# EAGLE design ADC4 (EAGLE 9.2.2)
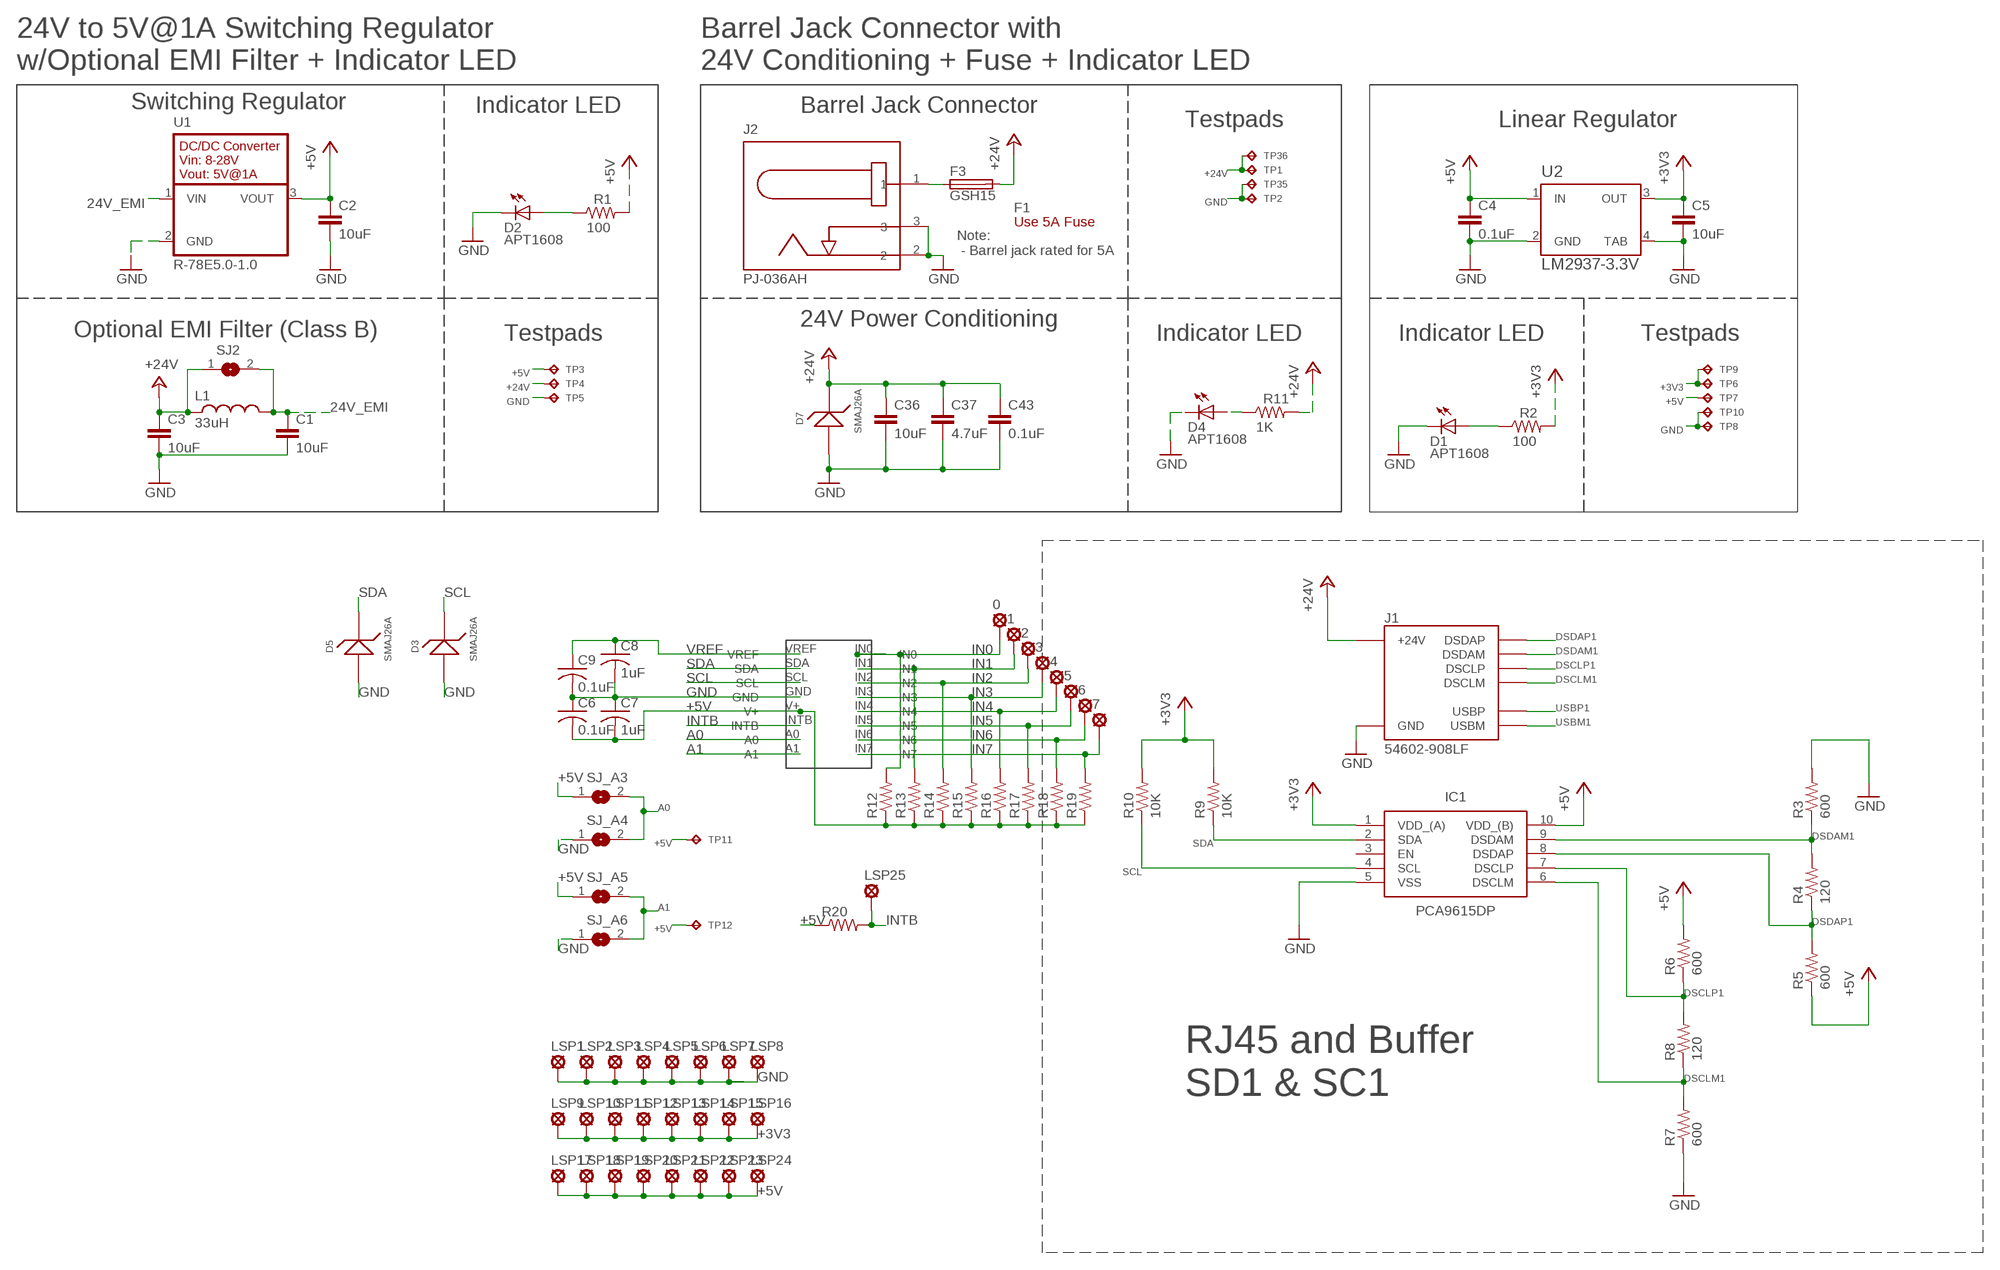
[diagram p0: schematic, sheet 1]

## Parts
0  LSP13  [LSP13]
1  LSP13  [LSP13]
2  LSP13  [LSP13]
3  LSP13  [LSP13]
4  LSP13  [LSP13]
5  LSP13  [LSP13]
6  LSP13  [LSP13]
7  LSP13  [LSP13]
C1  10uF  10UF-GMK212BBJ106KG-T  [C0805]
C2  10uF  10UF-GMK212BBJ106KG-T  [C0805]
C3  10uF  10UF-GMK212BBJ106KG-T  [C0805]
C4  0.1uF  0.1UF-C0603C104K5RACTU  [C0603]
C5  10uF  10UF-GMK212BBJ106KG-T  [C0805]
C6  0.1uF  C-USC0603  [C0603]
C7  1uF  C-USC0603  [C0603]
C8  1uF  C-USC0603  [C0603]
C9  0.1uF  C-USC0603  [C0603]
C36  10uF  10UF-GMK212BBJ106KG-T  [C0805]
C37  4.7uF  4.7UF-CL21A475KBQNNNE  [C0805]
C43  0.1uF  0.1UF-C0603C104K5RACTU  [C0603]
D1  APT1608  APT1608CGCK  [CHIPLED_0603]
D2  APT1608  APT1608CGCK  [CHIPLED_0603]
D3  SMAJ26A  SMAJ26A-13-F  [SMA]
D4  APT1608  APT1608CGCK  [CHIPLED_0603]
D5  SMAJ26A  SMAJ26A-13-F  [SMA]
D7  SMAJ26A  SMAJ26A-13-F  [SMA]
F1  Use 5A Fuse  0217005.MXP  [FUSE-CARTRIDGE]
F3  GSH15  [GSH15]
IC1  PCA9615DP  [SOP50P490X110-10N]
J1  54602-908LF  OPENAG-V1-RJ45PTH  [OPENAG-V1-RJ45]
J2  PJ-036AH  BARREL-JACK-PJ-036AH-SMT-TR  [BARREL-JACK-PJ-036AH]
L1  33uH  33UH-29333C  [29333C]
LSP1  LSP13  [LSP13]
LSP2  LSP13  [LSP13]
LSP3  LSP13  [LSP13]
LSP4  LSP13  [LSP13]
LSP5  LSP13  [LSP13]
LSP6  LSP13  [LSP13]
LSP7  LSP13  [LSP13]
LSP8  LSP13  [LSP13]
LSP9  LSP13  [LSP13]
LSP10  LSP13  [LSP13]
LSP11  LSP13  [LSP13]
LSP12  LSP13  [LSP13]
LSP13  LSP13  [LSP13]
LSP14  LSP13  [LSP13]
LSP15  LSP13  [LSP13]
LSP16  LSP13  [LSP13]
LSP17  LSP13  [LSP13]
LSP18  LSP13  [LSP13]
LSP19  LSP13  [LSP13]
LSP20  LSP13  [LSP13]
LSP21  LSP13  [LSP13]
LSP22  LSP13  [LSP13]
LSP23  LSP13  [LSP13]
LSP24  LSP13  [LSP13]
LSP25  LSP10  [LSP10]
R1  100  100OHM-RC0603JR-07100RL  [RC0603N]
R2  100  100OHM-RC0603JR-07100RL  [RC0603N]
R3  600  R-US_R0603  [R0603]
R4  120  R-US_R0603  [R0603]
R5  600  R-US_R0603  [R0603]
R6  600  R-US_R0603  [R0603]
R7  600  R-US_R0603  [R0603]
R8  120  R-US_R0603  [R0603]
R9  10K  R-US_R0603  [R0603]
R10  10K  R-US_R0603  [R0603]
R11  1K  1K-ERJ-PB3D1001V  [RC0603N]
R12  R-US_R0603  [R0603]
R13  R-US_R0603  [R0603]
R14  R-US_R0603  [R0603]
R15  R-US_R0603  [R0603]
R16  R-US_R0603  [R0603]
R17  R-US_R0603  [R0603]
R18  R-US_R0603  [R0603]
R19  R-US_R0603  [R0603]
R20  R-US_R0603  [R0603]
SJ2  EMI-BYPASS  [EMI-BYPASS]
SJ_A3  SOLDERJUMPERREFLOW_NOPASTE  [SJ1]
SJ_A4  SOLDERJUMPERREFLOW_NOPASTE  [SJ1]
SJ_A5  SOLDERJUMPERREFLOW_NOPASTE  [SJ1]
SJ_A6  SOLDERJUMPERREFLOW_NOPASTE  [SJ1]
TP1  TPTP04R  [TP04R]
TP2  TPTP04R  [TP04R]
TP3  TPTP06R  [TP06R]
TP4  TPTP06R  [TP06R]
TP5  TPTP06R  [TP06R]
TP6  TPTP04R  [TP04R]
TP7  TPTP04R  [TP04R]
TP8  TPTP04R  [TP04R]
TP9  TPTP04R  [TP04R]
TP10  TPTP04R  [TP04R]
TP11  TPTP04R  [TP04R]
TP12  TPTP04R  [TP04R]
TP35  TPTP04R  [TP04R]
TP36  TPTP04R  [TP04R]
U1  R-78E5.0-1.0  [R-78E5.0-1.0]
U2  LM2937-3.3V  LM2937IMP-3.3/NOPB  [MP04A]
U$1  ADC128D818  [TSSOP16]

## Nets
24V_EMI: C1.1 L1.2 SJ2.2 U1.1(VIN)
24V_IN: F3.1 J2.1
+3V3: C5.1 IC1.1(VDD_(A)) LSP9.MP LSP10.MP LSP11.MP LSP12.MP LSP13.MP LSP14.MP LSP15.MP LSP16.MP R2.2 R9.2 R10.2 TP6.1(TP) TP9.1(TP) U2.3(OUT)
+5V: C2.1 C4.1 C6.2 C7.2 IC1.10(VDD_(B)) LSP17.MP LSP18.MP LSP19.MP LSP20.MP LSP21.MP LSP22.MP LSP23.MP LSP24.MP R1.2 R5.1 R6.2 R12.1 R13.1 R14.1 R15.1 R16.1 R17.1 R18.1 R19.1 R20.1 SJ_A3.1 SJ_A5.1 TP3.TP TP7.1(TP) TP11.1(TP) TP12.1(TP) U1.3(VOUT) U2.1(IN) U$1.V+
+24V: C3.1 C36.1 C37.1 C43.1 D7.1 F3.2 J1.24V(6)(+24V) L1.1 R11.2 SJ2.1 TP1.1(TP) TP4.TP TP36.1(TP)
A0: SJ_A3.2 SJ_A4.2 U$1.A0
A1: SJ_A5.2 SJ_A6.2 U$1.A1
DSCLM1: IC1.6(DSCLM) J1.DSCLM(5)(DSCLM) R7.2 R8.1
DSCLP1: IC1.7(DSCLP) J1.DSCLP(4)(DSCLP) R6.1 R8.2
DSDAM1: IC1.9(DSDAM) J1.DSDAM(2)(DSDAM) R3.1 R4.2
DSDAP1: IC1.8(DSDAP) J1.DSDAP(1)(DSDAP) R4.1 R5.2
GND: C1.2 C2.2 C3.2 C4.2 C5.2 C6.1 C7.1 C8.2 C9.2 C36.2 C37.2 C43.2 D1.C D2.C D3.2 D4.C D5.2 D7.2 IC1.5(VSS) J1.GND(3)(GND) J2.2 J2.3 LSP1.MP LSP2.MP LSP3.MP LSP4.MP LSP5.MP LSP6.MP LSP7.MP LSP8.MP R3.2 R7.1 SJ_A4.1 SJ_A6.1 TP2.1(TP) TP5.TP TP8.1(TP) TP10.1(TP) TP35.1(TP) U1.2(GND) U2.2(GND) U2.4(TAB) U$1.GND
IN0: 0.MP R12.2 U$1.IN0
IN1: 1.MP R13.2 U$1.IN1
IN2: 2.MP R14.2 U$1.IN2
IN3: 3.MP R15.2 U$1.IN3
IN4: 4.MP R16.2 U$1.IN4
IN5: 5.MP R17.2 U$1.IN5
IN6: 6.MP R18.2 U$1.IN6
IN7: 7.MP R19.2 U$1.IN7
INTB: LSP25.MP R20.2 U$1.INTB
N$1: D1.A R2.1
N$2: D2.A R1.1
N$4: D4.A R11.1
SCL: D3.1 IC1.4(SCL) R10.1 U$1.SCL
SDA: D5.1 IC1.2(SDA) R9.1 U$1.SDA
USBM1: J1.USBM(8)(USBM)
USBP1: J1.USBP(7)(USBP)
VREF: C8.1 C9.1 U$1.VREF
Unconnected: IC1.3(EN)

## Notes on the sheet
- 24V to 5V@1A Switching Regulator
  w/Optional EMI Filter + Indicator LED
- Barrel Jack Connector with
  24V Conditioning + Fuse + Indicator LED
- Switching Regulator | Indicator LED | Barrel Jack Connector
- Testpads | Linear Regulator
- Note:
   - Barrel jack rated for 5A
- 24V Power Conditioning
- Optional EMI Filter (Class B) | Testpads | Indicator LED | Indicator LED | Testpads
- RJ45 and Buffer
  SD1 & SC1

## Library data of the parts
0 1-7 LSP1-LSP24 = solpad:LSP13: SOLDER PAD drill 1.3 mm, distributor Buerklin, 12H562
C1-C3 C5 C36 = openag-capacitors:10UF-GMK212BBJ106KG-T: CAP CER 10UF 35V X5R 0805 Description: 10µF ±10% 35V Ceramic Capacitor X5R 0805 (2012 Metric) Technical Specifications: Capacitance: 10µF Tolerance: ±10% Rated Voltage: 35V Temperature Coefficient: X5R Operating Temperature: -55°C ~ 85°C Package / Case: 0805 (2012 Metric) Datasheet(s): GMK212BBJ106KG-T Spec <http://ds.yuden.co.jp/TYCOMPAS/ut/detail.do?productNo=GMK212BBJ106KG-T&fileName=GMK212BBJ106KG-T_SS&mode=specSheetDownload> Vendor(s): Digikey: 587-4893-1-ND <https://www.digikey.com/product-detail/en/taiyo-yuden/GMK212BBJ106KG-T/587-4893-1-ND/6563736>; MANUFACTURER: Taiyo Yuden; MPN: GMK212BBJ106KG-T; VENDOR: Digikey; VLINK: https://www.digikey.com/product-detail/en/taiyo-yuden/GMK212BBJ106KG-T/587-4893-1-ND/6563736; VPN: 587-4893-1-ND
C4 C43 = openag-capacitors:0.1UF-C0603C104K5RACTU: CAP CER 0.1UF 50V X7R 0603 Description: 0.1µF ±10% 50V Ceramic Capacitor X7R 0603 (1608 Metric) Technical Specifications: Capacitance: 0.1µF Tolerance: ±10% Rated Voltage: 50V Temperature Coefficient: X7R Operating Temperature: -55°C ~ 125°C Package / Case: 0603 (1608 Metric) Datasheet(s): X7R Dielectric, 6.3-250 VDC <https://search.kemet.com/component-edge/download/datasheet/C0603C104K5RACTU.pdf> Vendor(s): Digikey: 399-5089-1-ND <https://www.digikey.com/product-detail/en/kemet/C0603C104K5RACTU/399-5089-1-ND/1465623>; MANUFACTURER: Kemet; MPN: C0603C104K5RACTU; VENDOR: Digikey; VLINK: https://www.digikey.com/product-detail/en/kemet/C0603C104K5RACTU/399-5089-1-ND/1465623; VPN: 399-5089-1-ND
C6-C9 = rcl:C-US: CAPACITOR, American symbol; SPICEPREFIX: C
C37 = openag-capacitors:4.7UF-CL21A475KBQNNNE: CAP CER 4.7UF 50V X5R 0805 Description: 4.7µF ±10% 50V Ceramic Capacitor X5R 0805 (2012 Metric) Technical Specifications: Capacitance: 4.7uF Tolerance: ±10% Rated Voltage: 50V Temperature Coefficient: X5R Operating Temperature: -55°C ~ 85°C Package/Case: 0805 (2012 Metric) Datasheet(s): CL21A475KBQNNNE Characteristics <http://www.samsungsem.com/kr/front/downloadcms.do?path=/kr/support/product-search/mlcc/__icsFiles/afieldfile/2014/11/05&fileName=C_CL21A475KBQNNNE.pdf> Vendor(s): Digikey: 1276-1248-1-ND <https://www.digikey.com/product-detail/en/samsung-electro-mechanics/CL21A475KBQNNNE/1276-1248-1-ND/3889334>; MANUFACTURER: Samsung; MPN: CL21A475KBQNNNE; VENDOR: Digikey; VLINK: https://www.digikey.com/product-detail/en/samsung-electro-mechanics/CL21A475KBQNNNE/1276-1248-1-ND/3889334; VPN: 1276-1248-1-ND
D1 D2 D4 = openag-diodes:APT1608CGCK: LED GREEN CLEAR 0603 SMD Description: Green 570nm LED Indication - Discrete 2.1V 0603 (1608 Metric) Technical Specifications: Color: Green Lens Color: Colorless Lens Transparency: Clear Millicandela Rating: 50mcd Lens Style/Size: Rectangle with Flat Top, 1.20mm x 0.80mm Voltage - Forward (Vf) (Typ): 2.1V Current - Test: 20mA Viewing Angle: 120° Mounting Type: Surface Mount Wavelength - Dominant: 570nm Wavelength - Peak: 574nm Package / Case: 0603 (1608 Metric) Supplier Device Package: Chip LED Size / Dimension: 1.60mm L x 0.80mm W Height (Max): 0.75mm Datasheet(s): APT1608CGCK <http://www.kingbrightusa.com/images/catalog/SPEC/APT1608CGCK.pdf> Vendor(s): Digikey: 754-1116-1-ND <https://www.digikey.com/product-detail/en/kingbright/APT1608CGCK/754-1116-1-ND/1747833#>; MANUFACTURER: Kingbright; MPN: APT1608CGCK; VENDOR: Digikey; VLINK: https://www.digikey.com/product-detail/en/kingbright/APT1608CGCK/754-1116-1-ND/1747833#; VPN: 754-1116-1-ND
D3 D5 D7 = openag-diodes:SMAJ26A-13-F: TVS DIODE 26VWM 42.1VC SMA Description: TVS DIODE 26VWM 42.1VC SMA Technical Specifications: Type: Zener Voltage - Reverse Standoff (Typ): 26V Voltage - Breakdown (Min): 28.9V Voltage - Clamping (Max) @ Ipp: 42.1V Current - Peak Pulse (10/1000µs): 9.5A Power - Peak Pulse: 400W Power Line Protection: No Operating Temperature: -55°C ~ 150°C (TJ) DO-214AC, SMA Datasheet(s): SMAJ5.0(C)A - SMAJ200(C)A Vendor(s): Digikey: SMAJ26A-FDICT-ND <https://www.digikey.com/product-detail/en/diodes-incorporated/SMAJ26A-13-F/SMAJ26A-FDICT-ND/806583>; MANUFACTURER: Diodes Incorporated; MPN: SMAJ26A-13-F; VENDOR: Digikey; VLINK: https://www.digikey.com/product-detail/en/diodes-incorporated/SMAJ26A-13-F/SMAJ26A-FDICT-ND/806583; VPN: SMAJ26A-FDICT-ND
F1 = openag-fuses:0217005.MXP: FUSE GLASS 5A 250VAC 5X20MM Description: FUSE GLASS 5A 250VAC 5X20MM Technical Specifications: Fuse Type: Cartridge, Glass Current Rating: 5A Voltage Rating - AC: 250V Response Time: Fast Package / Case: 5mm x 20mm Mounting Type: Holder Breaking Capacity @ Rated Voltage: 50A Melting I²t: 42.795 Approvals: BSI, CE, CCC, CSA, KC, PSE, SEMKO, UR, VDE Operating Temperature: -55°C ~ 125°C Size / Dimension: 0.205" Dia x 0.787" L (5.20mm x 20.00mm) DC Cold Resistance: 0.0137 Ohms Datasheet(s): 217 Series Datasheet <http://www.littelfuse.com/~/media/electronics/datasheets/fuses/littelfuse_fuse_217_datasheet.pdf.pdf> Vendor(s): Digikey: F1725-ND <https://www.digikey.com/product-detail/en/littelfuse-inc/0217005.MXP/F1725-ND/777549#>; MANUFACTURER: Littelfuse Inc.; MPN: 0217005.MXP; VENDOR: Digikey; VLINK: https://www.digikey.com/product-detail/en/littelfuse-inc/0217005.MXP/F1725-ND/777549; VPN: F1725-ND
F3 = openag-fuses:GSH15: FUSE BLOCK CART 250V 6.3A PCB Description: Fuse Block 6.3A 250V 1 Circuit Cartridge PCB Technical Specifications: Fuseholder Type: Block Fuse Type: Cartridge For Use With/Related Products: 5mm x 20mm Fuse Size: 5mm x 20mm Number of Circuits: 1 Voltage: 250V Current Rating: 6.3A Mounting Type: PCB Orientation: Horizontal Termination Style: PC Pin Contact Material: Copper Alloy Contact Finish: Tin Datasheet(s): 649 Series <http://www.littelfuse.com/~/media/electronics/datasheets/fuse_blocks/littelfuse_fuse_block_649_datasheet.pdf.pdf> Vendor(s): Digikey: WK0011-ND <https://www.digikey.com/product-detail/en/littelfuse-inc/64900001039/WK0011-ND/245470>; MANUFACTURER: Littelfuse Inc.; MPN: 64900001039; VENDOR: Digikey; VLINK: https://www.digikey.com/product-detail/en/littelfuse-inc/64900001039/WK0011-ND/245470; VPN: WK0011-ND
IC1 = PCA9615DP:PCA9615DP: Buffer, ReDriver 2 Channel 400kHz 10-TSSOP Source: Datasheet <http://www.nxp.com/docs/en/data-sheet/PCA9615.pdf>; DESCRIPTION: Buffer, ReDriver 2 Channel 400kHz 10-TSSOP; HEIGHT: 1.1mm; MANUFACTURER_NAME: Nexperia; MANUFACTURER_PART_NUMBER: PCA9615DP; SUPPLIER_NAME: RS
J1 = openag_connector:OPENAG-V1-RJ45: Amphenol FCI - 54602-908LF - CONN MOD JACK 8P8C R/A UNSHLD Description: Jack Modular Connector 8p8c (RJ45, Ethernet) 90� Angle (Right) Unshielded Cat3 Technical Specifications: Connector Type: Jack Number of Positions/Contacts: 8p8c (RJ45, Ethernet) Number of Ports: 1 Number of Rows: 1 Mounting Type: Through Hole Orientation: 90� Angle (Right) Termination: Solder Shielding: Unshielded Ratings: Cat3 Features: Board Lock LED Color: Does Not Contain LED Tab Direction: Down Contact Material: Copper Alloy Contact Finish: Gold Contact Finish Thickness: 15�in (0.38�m) Housing Material: Polyester, Glass Filled Operating Temperature: -40�C ~ 70�C Datasheet(s): 54601-x04(zzz)WPLF Drawing <http://cdn.amphenol-icc.com/media/wysiwyg/files/drawing/c-bmj-0102.pdf> Vendor(s): Digikey: 609-1046-ND <https://www.digikey.com/product-detail/en/amphenol-fci/54602-908LF/609-1046-ND/1001360>; POPULATE: YES; VERIFIED: NO
J2 = openag-connectors:BARREL-JACK-PJ-036AH-SMT-TR: CONN PWR JACK 2X5.5MM SOLDER Description: Power Barrel Connector Jack 2.10mm ID (0.083"), 5.50mm OD (0.217") Surface Mount, Right Angle Technical Specifications: Connector Type: Jack Gender: Male Industry Recognized Mating Diameter: 2.10mm ID (0.083"), 5.50mm OD (0.217") Actual Diameter: 0.078" (2.00mm ID), 0.248" (6.30mm OD) Number of Positions/Contacts: 2 Conductors, 3 Contacts Internal Switch(s): Single Switch, Normally Closed Mounting Type: Surface Mount, Right Angle Termination: Solder Shielding: Unshielded Voltage - Rated: 24VDC Current Rating: 5A Mating Length/Depth: 0.360" (9.15mm) Contact Material - Plating: Silver Operating Temperature: -25°C ~ 85°C Housing Material: Polyamide (PA6T), Nylon 6T Contact Material: Brass; Copper Alloy Body Color: Black Datasheet(s): PJ-036AH-SMT-TR <http://www.cui.com/product/resource/digikeypdf/pj-036ah-smt-tr.pdf> Vendor(s): Digikey: CP-036AHPJCT-ND <https://www.digikey.com/product-detail/en/cui-inc/PJ-036AH-SMT-TR/CP-036AHPJCT-ND/1530994>; MANUFACTURER: CUI Inc.; MPN: PJ-036AH-SMT-TR; VENDOR: Digikey; VLINK: https://www.digikey.com/product-detail/en/cui-inc/PJ-036AH-SMT-TR/CP-036AHPJCT-ND/1530994; VPN: CP-036AHPJCT-ND
L1 = openag-inductors:33UH-29333C: FIXED IND 33UH 1A 120 MOHM SMD Description: 33µH Shielded Wirewound Inductor 1A 120 mOhm Max Nonstandard Technical Specifications: Type: Wirewound Inductance: 33µH Current Rating: 1A Shielding: Shielded DC Resistance (DCR): 120 mOhm Max Operating Temperature: -40°C ~ 85°C Frequency - Test: 10kHz Mounting Type: Surface Mount Package / Case: Nonstandard Size / Dimension: 0.283" L x 0.283" W (7.20mm x 7.20mm) Height - Seated (Max): 0.157" (4.00mm) Datasheet(s): 2900 Series <https://www.murata-ps.com/data/magnetics/kmp_2900.pdf> Vendor(s): Digikey: 811-1138-1-ND <https://www.digikey.com/product-detail/en/murata-power-solutions-inc/29333C/811-1138-1-ND/1924860>; MANUFACTURER: Murata Power Solutions Inc.; MPN: 29333C; VENDOR: Digikey; VLINK: https://www.digikey.com/product-detail/en/murata-power-solutions-inc/29333C/811-1138-1-ND/1924860; VPN: 811-1138-1-ND
LSP25 = solpad:LSP10: SOLDER PAD drill 1.0 mm, distributor Buerklin, 12H555
R1 R2 = openag-resistors:100OHM-RC0603JR-07100RL: RES SMD 100 OHM 5% 1/10W 0603 Description: 100 Ohms ±5% 0.1W, 1/10W Chip Resistor 0603 (1608 Metric) Moisture Resistant Thick Film Technical Specifications: Resistance: 100 Ohms Tolerance: ±5% Power (Watts): 0.1W, 1/10W Composition: Thick Film Features: Moisture Resistant Temperature Coefficient: ±100ppm/°C Operating Temperature: -55°C ~ 155°C Package / Case: 0603 (1608 Metric) Supplier Device Package: 0603 Size / Dimension: 0.063" L x 0.032" W (1.60mm x 0.80mm) Height - Seated (Max): 0.022" (0.55mm) Number of Terminations: 2 Datasheet(s): Thick Film Chip Resistor Intro <http://www.yageo.com.tw/exep/pages/download/literatures/PYu-R_INT-thick_7.pdf> Chip Resistor Marking <http://www.yageo.com/exep/pages/download/literatures/PYu-R_Marking_2.pdf> RC Series, L Datasheet <http://www.yageo.com/documents/recent/PYu-RC_Group_51_RoHS_L_8.pdf> Vendor(s): Digikey: 311-100GRCT-ND <https://www.digikey.com/product-detail/en/yageo/RC0603JR-07100RL/311-100GRCT-ND/729644>; MANUFACTURER: Yageo; MPN: RC0603JR-07100RL; VENDOR: Digikey; VLINK: https://www.digikey.com/product-detail/en/yageo/RC0603JR-07100RL/311-100GRCT-ND/729644; VPN: 311-100GRCT-ND
R3-R10 R12-R19 = rcl:R-US_: RESISTOR, American symbol; SPICEPREFIX: R
R11 = openag-resistors:1K-ERJ-PB3D1001V: RES SMD 1K OHM 0.5% 1/5W 0603 Description: 1 kOhms ±0.5% 0.2W, 1/5W Chip Resistor 0603 (1608 Metric) Automotive AEC-Q200, Pulse Withstanding Thick Film Technical Specifications: Resistance: 1 kOhms Tolerance: ±0.5% Power: 0.2W, 1/5W Operating Temperature: -55°C ~ 155°C Package / Case: 0603 (1608 Metric) Datasheet(s): ERJ-PB3, PB6 Series, High Precision Datasheet <https://industrial.panasonic.com/cdbs/www-data/pdf/RDM0000/AOA0000C328.pdf> Vendor(s): Digikey: P20283CT-ND <https://www.digikey.com/product-detail/en/panasonic-electronic-components/ERJ-PB3D1001V/P20283CT-ND/6214538>; MANUFACTURER: Panasonic; MPN: P20283CT-ND; VENDOR: Digikey; VLINK: https://www.digikey.com/product-detail/en/panasonic-electronic-components/ERJ-PB3D1001V/P20283CT-ND/6214538; VPN: P20283CT-ND
R20 = resistor:R-US_: RESISTOR, American symbol
SJ2 = openag-connectors:EMI-BYPASS: EMI Bypass Solder Jumper; MPN: N/A
SJ_A3-SJ_A6 = openag-connectors:SOLDERJUMPER: SMD Solder JUMPER Solder the two pads together to create a connection, or remove the solder to break it. REFLOW - Use this footprint for solder paste and reflow ovens. WAVE - Use this footprint for hand-soldering (larger pads). CLOSED - Has a trace between the two pads to ensure it is closed by default. The trace needs to be cut to disable the jumper, and can be closed again by creating a solder bridge between the two pads.; MPN: N/A
TP1-TP12 TP35 TP36 = openag-testpads:TP: Test pad; MPN: N/A
U1 = openag-regulators:R-78E5.0-1.0: DC/DC CONVERTER 5V 5W Description: Linear Regulator Replacement DC DC Converter 1 Output 5V 1A 8V - 28V Input Technical Specifications: Type: Linear Regulator Replacement Number of Outputs: 1 Voltage - Input (Min): 8V Voltage - Input (Max): 28V Voltage - Output 1: 5V Current - Output (Max): 1A Power (Watts): 5W Applications: ITE (Commercial) Features: SCP Operating Temperature: -40°C ~ 85°C Efficiency: 91% Mounting Type: Through Hole Package / Case: 3-SIP Module Size / Dimension: 0.46" L x 0.33" W x 0.41" H (11.6mm x 8.5mm x 10.4mm) Datasheet(s): R-78E-1.0 Series Datasheet <https://www.recom-power.com/pdf/Innoline/R-78Exx-1.0.pdf> Vendor(s): Digikey: 945-2201-ND <https://www.digikey.com/product-detail/en/recom-power/R-78E5.0-1.0/945-2201-ND/4930585>; MANUFACTURER: Recom Power; MPN: R-78E5.0-1.0; VENDOR: Digikey; VLINK: https://www.digikey.com/product-detail/en/recom-power/R-78E5.0-1.0/945-2201-ND/4930585; VPN: 945-2201-ND
U2 = openag-regulators:LM2937IMP-3.3/NOPB: IC REG LIN 3.3V 400MA SOT223-4 Description: Linear Voltage Regulator IC Positive Fixed 1 Output 3.3V 400mA SOT-223-4 Technical Specifications: Output Configuration: Positive Output Type: Fixed Number of Regulators: 1 Voltage - Input (Max): 26V Voltage - Output (Min/Fixed): 3.3V Voltage Dropout (Max): 1V @ 50mA Current - Output: 400mA Current - Quiescent (Iq): 2mA Current - Supply (Max): 1.25A Protection Features: Over Temperature, Reverse Polarity, Short Circuit Operating Temperature: -40°C ~ 85°C Mounting Type: Surface Mount Package / Case: TO-261-4, TO-261AA Supplier Device Package: SOT-223-4 Base Part Number: LM2937 Datasheet(s): LM2937-2.5, LM2937-3.3 Datasheet <http://www.ti.com/lit/ds/symlink/lm2937-2.5.pdf> Vendor(s): Digikey: LM2937IMP-3.3/NOPBCT-ND <https://www.digikey.com/product-detail/en/texas-instruments/LM2937IMP-3.3-NOPB/LM2937IMP-3.3-NOPBCT-ND/270742#>; MANUFACTURER: Texas Instruments; MPN: LM2937IMP-3.3/NOPB; VENDOR: Digikey; VLINK: https://www.digikey.com/product-detail/en/texas-instruments/LM2937IMP-3.3-NOPB/LM2937IMP-3.3-NOPBCT-ND/270742#; VPN: LM2937IMP-3.3/NOPBCT-ND
U$1 = untitled:ADC128D818

## Net classes
0 default: width 0.305 mm, drill 0.254 mm, clearance 0.254 mm

## Board
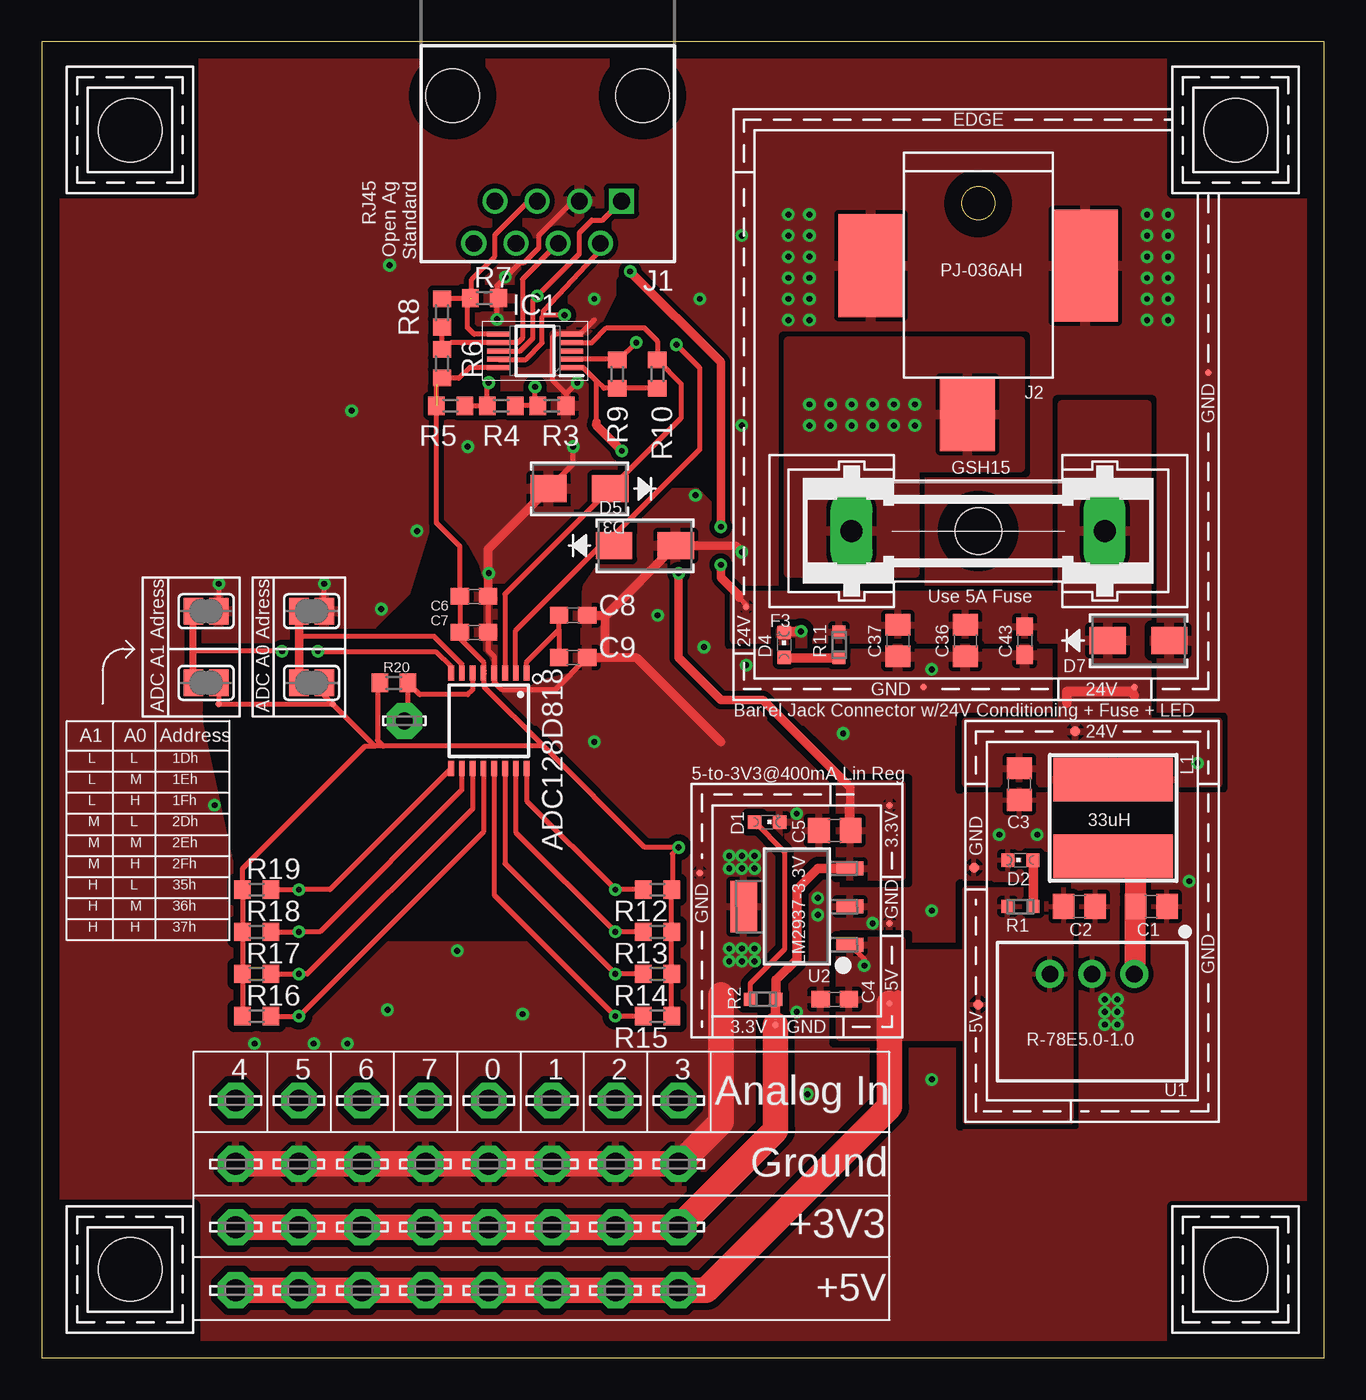
[diagram p1: board, top side]
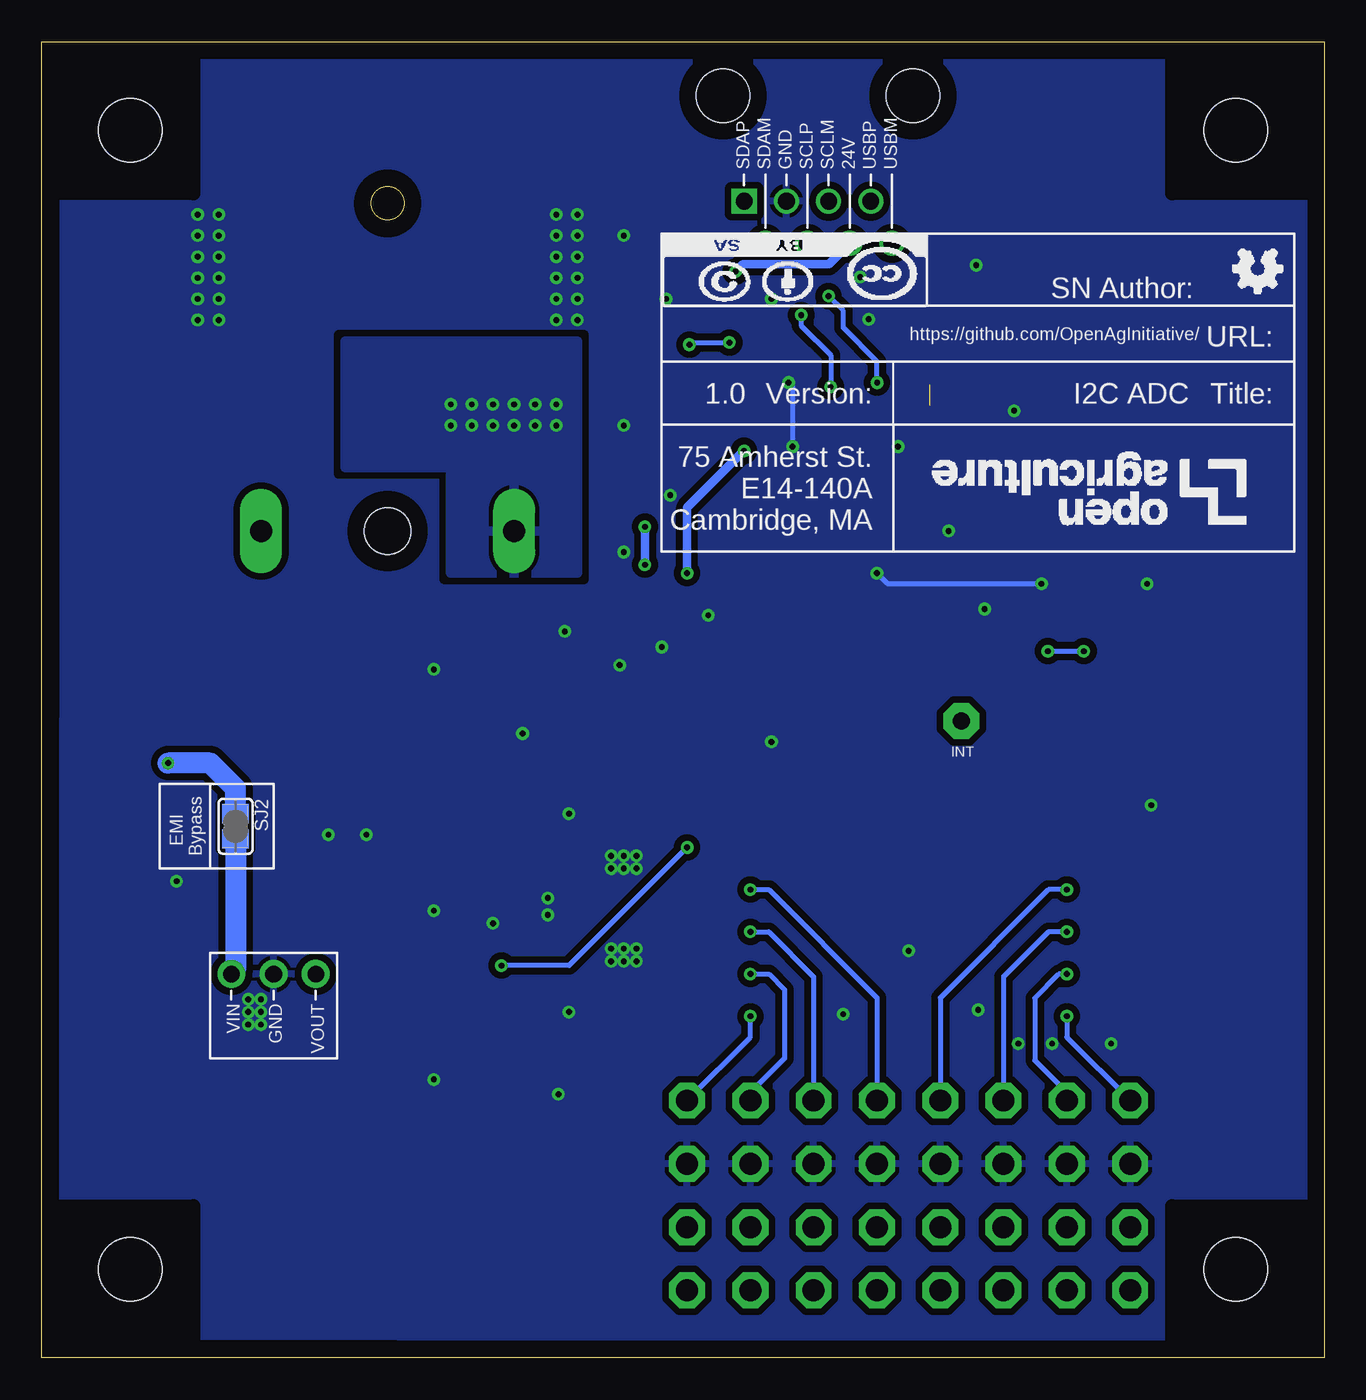
[diagram p2: board, bottom side, seen from below]

Size 77.22 x 79.25 mm. Coordinates in mm from the lower left corner, seen from the top.
Outline: 0,79.25 0,0 77.22,0 77.22,79.25 0,79.25
Copper layers (1*16): Top 0.035mm / dielectric 1.5mm / Bottom 0.035mm
Design rules "default": minimum track width 6mil, minimum drill 0.35mm, track to track 6mil, track to pad 6mil, pad to pad 6mil, via to via 6mil, smd to smd 6mil, copper to edge 40mil, drill to drill 6mil, minimum pad ring 10mil, minimum via ring 8mil, stop-mask expansion 4mil, vias tented up to drill 0mil, thermal gap 10mil
tRestrict: 18 lines

### Footprints (pad centres in the part's own frame; a part is rotated, then mirrored left to right if it is on the bottom)
LSP13 = drill 1.321 pad 2.159 octagon: MP 0,0
C0805 = smd 1.3 x 1.5: 1 -0.95,0; 2 0.95,0
C0603 = smd 1.1 x 1: 1 -0.85,0; 2 0.85,0
CHIPLED_0603 = smd 0.8 x 0.8: A 0,-0.75; C 0,0.75
SMA = smd 2.18 x 1.63: 1 -1.857,0; 2 1.857,0
GSH15 = drill 1.321 pad 2.54 long: 1 -7.62,0; 2 7.62,0 | hole 2.794: 0,0
SOP50P490X110-10N = smd 1.4 x 0.3: 1 -2.2,1; 2 -2.2,0.5; 3 -2.2,0; 4 -2.2,-0.5; 5 -2.2,-1; 6 2.2,-1; 7 2.2,-0.5; 8 2.2,0; 9 2.2,0.5; 10 2.2,1
OPENAG-V1-RJ45 = drill 1: 24V(6) 1.905,8.89; DSCLM(5) 0.635,6.35; DSCLP(4) -0.635,8.89; DSDAM(2) -3.175,8.89; GND(3) -1.905,6.35; USBM(8) 4.445,8.89; USBP(7) 3.175,6.35 | drill 1 square: DSDAP(1) -4.445,6.35 | hole 3.2: -5.715,0; 5.715,0
BARREL-JACK-PJ-036AH = smd 4.4 x 3.3: 1 2.2,-0.65 | smd 6.75 x 3.9: 2 -6.75,6.45 | smd 6.2 x 3.9: 3 -6.75,-6.45
29333C = smd 2.6 x 7.2: 1 -2.3,0; 2 2.3,0
LSP10 = drill 1.016 pad 2.159 octagon: MP 0,0
RC0603N = smd 0.756 x 0.8: 1 -0.778,0; 2 0.778,0
R0603 = smd 1 x 1.1: 1 -0.85,0; 2 0.85,0
EMI-BYPASS = smd 1.168 x 1.6: 1 -0.762,0.254; 2 0.762,0.254
SJ1 = smd 1.168 x 1.6: 1 -0.762,0; 2 0.762,0
TP04R = smd 0.4 x 0.4: 1 0,0
TP06R = smd 0.6 x 0.6: TP 0,0
R-78E5.0-1.0 = drill 1 pad 1.676: 1 -2.54,0; 2 0,0; 3 2.54,0
MP04A = smd 1.6 x 0.838: 1 -3.2,2.3; 2 -3.2,0; 3 -3.2,-2.3 | smd 1.6 x 3.099: 4 3.2,0
TSSOP16 = smd 0.9 x 0.35: A0 -2.875,-1.625; A1 -2.875,-2.275; GND -2.875,0.325; IN0 2.875,2.275; IN1 2.875,1.625; IN2 2.875,0.975; IN3 2.875,0.325; IN4 2.875,-0.325; IN5 2.875,-0.975; IN6 2.875,-1.625; IN7 2.875,-2.275; INTB -2.875,-0.975; SCL -2.875,0.975; SDA -2.875,1.625; V+ -2.875,-0.325; VREF -2.875,2.275
CORNER = hole 3.81: 0,0

### Placement (x,y rotation side)
0  26.92,15.49 0 top
1  30.73,15.49 0 top
2  34.54,15.49 0 top
3  38.35,15.49 0 top
4  11.68,15.49 0 top
5  15.49,15.49 0 top
6  19.3,15.49 0 top
7  23.11,15.49 0 top
ATTRIBUTES  [DOCFIELD]  1.79,67.67 180 bottom
C1  66.8,27.18 0 top
C2  62.48,27.18 0 top
C3  58.86,34.54 270 top
C4  47.75,21.59 180 top
C5  47.75,31.75 180 top
C6  26.04,45.85 180 top
C7  26.04,43.69 180 top
C8  32,44.7 0 top
C9  32,42.16 0 top
C36  55.63,43.18 270 top
C37  51.56,43.18 270 top
C43  59.18,43.18 270 top
D1  43.69,32.26 270 top
D2  58.93,29.97 90 top
D3  32.38,52.32 180 top
D4  44.7,42.93 0 top
D5  36.32,48.89 0 top
D7  66.04,43.18 0 top
F1  53.34,45.47 0 top
F3  56.39,49.78 0 top
IC1  29.71,60.62 180 top
J1  30.47,75.99 180 top
J2  56.39,59 270 top
L1  64.52,32.51 270 top
LSP1  11.68,11.68 0 top
LSP2  15.49,11.68 0 top
LSP3  19.3,11.68 0 top
LSP4  23.11,11.68 0 top
LSP5  26.92,11.68 0 top
LSP6  30.73,11.68 0 top
LSP7  34.54,11.68 0 top
LSP8  38.35,11.68 0 top
LSP9  11.68,7.87 0 top
LSP10  15.49,7.87 0 top
LSP11  19.3,7.87 0 top
LSP12  23.11,7.87 0 top
LSP13  26.92,7.87 0 top
LSP14  30.73,7.87 0 top
LSP15  34.54,7.87 0 top
LSP16  38.35,7.87 0 top
LSP17  11.68,4.06 0 top
LSP18  15.49,4.06 0 top
LSP19  19.3,4.06 0 top
LSP20  23.11,4.06 0 top
LSP21  26.92,4.06 0 top
LSP22  30.73,4.06 0 top
LSP23  34.54,4.06 0 top
LSP24  38.35,4.06 0 top
LSP25  21.84,38.35 0 top
R1  58.93,27.18 180 top
R2  43.43,21.59 0 top
R3  30.72,57.32 0 top
R4  27.68,57.32 0 top
R5  24.63,57.32 0 top
R6  24.12,59.86 270 top
R7  26.66,63.8 180 top
R8  24.12,62.91 270 top
R9  34.66,59.23 270 top
R10  37.07,59.23 270 top
R11  48.01,42.93 90 top
R12  37.08,28.19 180 top
R13  37.08,25.65 180 top
R14  37.08,23.11 180 top
R15  37.08,20.57 180 top
R16  12.95,20.57 0 top
R17  12.95,23.11 0 top
R18  12.95,25.65 0 top
R19  12.95,28.19 0 top
R20  21.21,40.64 0 top
SJ2  65.79,32 270 bottom
SJ_A3  16.26,40.64 180 top
SJ_A4  16.26,44.96 180 top
SJ_A5  9.91,40.64 180 top
SJ_A6  9.91,44.96 180 top
TP1  65.79,40.39 0 top
TP2  53.09,40.39 0 top
TP3  56.39,21.27 180 top
TP4  62.23,37.72 180 top
TP5  56.13,29.53 180 top
TP6  44.2,20.07 90 top
TP7  51.05,21.34 90 top
TP8  39.62,29.21 90 top
TP9  51.05,33.27 90 top
TP10  51.05,26.16 90 top
TP11  17.53,39.37 180 top
TP12  10.67,39.37 180 top
TP35  70.23,59.31 0 top
TP36  42.42,45.21 0 top
U1  63.25,23.11 180 top
U2  45.47,27.18 180 top
U$1  26.92,38.35 270 top
U$2  [CORNER]  5.33,73.91 270 top
U$3  [CORNER]  71.88,5.33 90 top
U$4  [CORNER]  71.88,73.91 180 top
U$5  [CORNER]  5.33,5.33 0 top

### Tracks (layer width: path | path; a pad name or v marks a point on that pad's centre or on a via)
24V_EMI
  Top 1.27: U1.1 65.85,23.18 C1.1 65.85,28.88 arc90 L1.2
  Bottom 1.27: SJ2.2 65.53,23.37 U1.1
24V_IN  (via drill 0.35)
  other vias: 52.58,57.4 52.58,56.13 51.31,57.4 51.31,56.13 50.04,57.4 50.04,56.13 48.77,57.4 47.5,57.4 47.5,56.13 48.77,56.13 46.23,56.13 46.23,57.4
  pour Bottom (isolate 0.406): 52.58,47.24 44.96,47.24 44.96,61.21 58.93,61.21 58.93,53.59 52.58,53.59
  pour Top (isolate 0.406): 44.96,47.24 52.58,47.24 52.58,53.59 58.93,53.59 58.93,61.21 44.96,61.21
+3V3  (via drill 0.35)
  Top 0.305: IC1.1 32.61,59.62 33.42,58.82 | 33.42,58.82 33.86,58.38 R9.2 R10.2 | C5.1 48.51,31.94 48.51,33.27 | 40.26,40.26 40.89,39.62 | 33.42,58.82 33.42,56.33 33.26,56.18 34.83,54.61 v34.92,54.61
  Top 0.508: C5.1 48.7,34.36 43.43,39.62 40.89,39.62 38.35,42.16 v38.35,47.24 | v34.92,54.61 33.42,56.12 33.42,56.33
  Top 0.559: TP6.1 44.2,21.57 R2.2 44.21,22.75 45.47,24 45.47,28.19 46.75,29.48 U2.3
  Top 1.524: LSP9.MP LSP10.MP LSP11.MP LSP12.MP LSP13.MP LSP14.MP LSP15.MP LSP16.MP 44.2,13.72 TP6.1
  Bottom 0.508: v38.35,47.24 38.35,51.18 v34.92,54.61
  pour Top (isolate 0.305): 51.82,34.54 48.01,34.54 48.01,28.96 51.82,28.96
+5V  (via drill 0.35)  (1 unrouted)
  Top 0.305: U2.1 49.53,24.01 v49.53,23.62 | IC1.10 25.79,59.62 25.14,58.97 24.16,58.97 | 24.16,58.97 R6.2 | 24.16,58.97 23.78,58.59 23.78,50.26 25.18,48.86 C6.2 C7.2 25.18,43.31 26.6,41.89 26.6,41.4 | 26.6,41.4 U$1.V+ 26.64,41.19 | 30.21,36.83 26.64,40.4 26.64,41.36 26.6,41.4 | 30.21,36.83 36.31,30.73 v38.35,30.73 37.97,30.35 37.97,28.23 R12.1 R13.1 R14.1 R15.1 | TP11.1 17.02,39.88 SJ_A3.1 | SJ_A5.1 TP12.1 TP11.1 | 30.21,36.83 20.57,36.83 | 20.57,36.83 20.07,36.83 | 20.07,36.83 TP11.1 | R16.1 R17.1 R18.1 R19.1 12.1,29.46 19.47,36.83 20.07,36.83 | R20.1 20.23,40.51 20.23,37.17 20.57,36.83
  Top 0.559: TP7.1 51.56,21.84
  Top 1.524: LSP17.MP LSP18.MP LSP19.MP LSP20.MP LSP21.MP LSP22.MP LSP23.MP LSP24.MP 40,4.06 51.05,15.11 TP7.1
  Bottom 0.305: v38.35,30.73 38.35,30.72 45.45,23.62 v49.53,23.62
  pour Top (isolate 0.305): 55.63,14.22 55.63,28.19 61.98,28.19 61.98,14.22
  pour Top (isolate 0.406): 56.9,28.19 55.63,28.19 55.63,23.11 56.9,23.11
  pour Top (isolate 0.305): 51.82,19.3 51.82,25.15 48.01,25.15 48.01,19.3
  pour Top (isolate 0.406): 55.63,24.38 50.55,24.38 50.55,19.3 55.63,19.3
+24V  (via drill 0.35)
  Top 0.305: TP1.1 65.79,39.88 | 41.97,45.78 42.42,45.34 TP36.1
  Top 0.508: v40.89,47.75 40.89,46.99 41.97,45.91 41.97,45.78 | v35.43,65.41 40.89,59.94 v40.89,50.04
  Top 0.559: 61.72,39.43 61.72,40.13 65.53,40.13 65.79,39.88
  Bottom 0.508: v35.43,65.41 35,65.84 29.83,65.84 J1.24V(6) | v40.89,50.04 v40.89,47.75
  Bottom 1.27: SJ2.1 65.53,34.29 67.06,35.81 v69.6,35.81
  pour Top (isolate 0.406): 66.55,38.35 66.55,57.4 61.47,57.4 61.47,38.35
  pour Top (isolate 0.406): 61.98,45.97 61.98,43.18 41.66,43.18 41.66,45.97
  pour Top (isolate 0.406): 55.63,34.54 55.63,38.35 70.87,38.35 70.87,34.54
A0
  Top 0.305: U$1.A0 25.3,41.78 23.64,43.43 15.49,43.43
  Top 0.508: SJ_A3.2 15.49,43.43 SJ_A4.2
A1  (via drill 0.35)
  Top 0.305: U$1.A1 24.65,41.61 23.77,42.49 16.69,42.49 v16.64,42.55 | v14.48,42.55 9.14,42.55
  Top 0.406: SJ_A5.2 9.14,42.55 SJ_A6.2
  Bottom 0.305: v16.64,42.55 v14.48,42.55
DSCLM1  (1 unrouted)
  Top 0.305: R8.1 24.16,63.8 25.64,63.8 | 25.64,63.8 R7.2 | IC1.6 26.04,61.62 25.64,62.02 25.64,63.8 | 25.9,63.8 25.9,64.94 27.3,66.34 27.3,67.61 29.33,69.64 J1.DSCLM(5)
DSCLP1
  Top 0.305: R8.2 R6.1 24.67,61.13 25.14,61.13 25.27,61.12 IC1.7 28.68,61.12 28.95,61.38 28.95,64.94 J1.DSCLP(4)
DSDAM1  (via drill 0.35)
  Top 0.305: J1.DSDAM(2) 33.64,66.72 30.22,63.03 30.22,62.78 | IC1.9 27.52,60.11 29.16,60.11 30.14,61.1 30.14,62.68 30.22,62.76 30.22,62.78 | R4.2 R3.1 arc-90 29.71,57.49 v29.71,58.46 29.71,58.59 | v31.49,62.78 30.22,62.78
  Bottom 0.305: v31.49,62.78 31.49,62.15 29.71,60.37 v29.71,58.46
DSDAP1  (via drill 0.35)
  Top 0.305: R5.2 R4.1 26.83,58.63 v26.91,58.72 | J1.DSDAP(1) 33.77,68.5 33.14,68.5 32.38,67.73 32.38,66.46 v29.84,63.92 29.58,63.67 29.58,61.38 28.82,60.62 IC1.8
  Bottom 0.305: v26.91,58.72 26.91,59.99 28.95,62.02 28.95,63.03 v29.84,63.92
GND  (via drill 0.35)
  Top 0.305: C6.1 C7.1 26.89,42.58 27.25,42.22 U$1.GND 27.25,40.68 27.68,40.25 30.94,40.25 C9.2 | v32.25,58.72 31.57,58.04 | 31.57,58.04 R3.2 | 31.57,58.04 30.73,58.88 30.73,61.47 30.89,61.62 IC1.5 32.41,61.62 33.27,62.48 | D3.2 32,53.8 v32,54.86 | v10.67,46.61 SJ_A6.1 | SJ_A4.1 v17.02,46.61 | v27.42,62.53 27.42,63.71 | 27.42,63.71 R7.1 | 27.42,63.71 27.42,64.56 v27.93,65.07 28.8,65.94 29.05,65.94 29.94,66.84 29.94,67.58 32,69.64 J1.GND(3) | 26.89,47.24 v26.92,47.24
  Top 0.508: C9.2 33.91,42.16 | 33.91,42.16 35.81,42.16 40.89,37.08 | C8.2 33.99,44.7 | 33.99,44.7 33.91,44.62 33.91,42.16 | 33.99,44.7 D5.2 41.78,48.89 v42.16,48.51 | D3.2 26.89,48.68 26.89,47.24 C6.1
  Top 0.559: D4.C 44.77,43.74 v45.72,43.74
  Top 1.524: 40.89,21.84 40.89,14.18 38.4,11.68 LSP8.MP LSP7.MP LSP6.MP LSP5.MP LSP4.MP LSP3.MP LSP2.MP LSP1.MP
  Bottom 0.305: v32.25,58.72 32,58.47 v32,54.86 | v26.92,47.24 26.29,46.61 v17.02,46.61
  other vias: 46.23,68.83 46.23,67.56 46.23,66.29 46.23,65.02 46.23,63.75 46.23,62.48 44.96,62.48 44.96,63.75 44.96,65.02 44.96,66.29 44.96,67.56 44.96,68.83 66.55,68.83 66.55,67.56 66.55,66.29 66.55,65.02 66.55,63.75 66.55,62.48 67.82,62.48 67.82,63.75 67.82,65.02 67.82,66.29 67.82,67.56 67.82,68.83 53.59,41.45 42.42,41.71 59.94,31.5 69.09,28.7 64.01,21.59 64.01,20.83 64.77,20.83 64.77,21.59 64.01,20.07 64.77,20.07 57.66,31.5 42.16,24.64 42.93,24.64 42.16,23.88 42.93,23.88 41.4,24.64 41.4,23.88 42.93,29.46 42.93,30.23 42.16,29.46 41.4,29.46 42.16,30.23 41.4,30.23 46.74,26.67 45.47,32.77 46.74,27.69 45.47,20.83 50.04,26.16 46.1,15.88 53.59,16.76 53.59,26.92 20.96,65.79 18.67,57.02 20.45,45.09 39.62,63.75 39.37,51.94 33.27,63.75 20.83,20.95 25.02,24.51 28.96,20.7 33.27,37.08 39.88,42.8 48.26,37.59 42.16,67.56 42.16,56.13 22.61,49.78 25.65,54.86 37.08,44.7 10.41,33.27 12.83,18.92 16.38,18.92 18.41,18.92
  pour Top (isolate 0.305, rank 2): 1.02,38.35 1.02,78.99 75.95,78.99 75.95,38.35
  pour Bottom (isolate 0.406, rank 2): 1.02,78.99 75.95,78.99 75.95,38.35 1.02,38.35
  pour Top (isolate 0.305, rank 2): 55.63,1.02 55.63,38.35 76.2,38.35 76.2,1.02
  pour Bottom (isolate 0.406, rank 2): 76.07,1.27 76.07,38.35 55.63,38.35 55.63,1.27
  pour Top (isolate 0.406, rank 3): 1.02,0.25 55.63,0.25 55.63,38.35 1.02,38.35
  pour Bottom (isolate 0.406): 1.02,0.25 1.02,38.35 55.63,38.35 55.63,0.25
IN0  (via drill 0.35)
  Top 0.305: R12.2 v34.54,28.19 29.2,33.54 U$1.IN0
  Bottom 0.305: v34.54,28.19 33.43,28.19 26.92,21.68 0.MP
IN1  (via drill 0.35)
  Top 0.305: R13.2 v34.54,25.65 28.55,31.65 U$1.IN1
  Bottom 0.305: v34.54,25.65 33.43,25.65 30.73,22.95 1.MP
IN2  (via drill 0.35)
  Top 0.305: R14.2 v34.54,23.11 27.9,29.76 U$1.IN2
  Bottom 0.305: 2.MP 34.54,15.98 32.49,18.03 32.49,22.17 33.43,23.11 v34.54,23.11
IN3  (via drill 0.35)
  Top 0.305: R15.2 v34.54,20.57 27.25,27.87 U$1.IN3
  Bottom 0.305: v34.54,20.57 34.54,19.3 3.MP
IN4  (via drill 0.35)
  Top 0.305: R16.2 v15.49,20.57 26.6,31.68 U$1.IN4
  Bottom 0.305: v15.49,20.57 15.49,19.3 4.MP
IN5  (via drill 0.35)
  Top 0.305: R17.2 v15.49,23.11 16,23.11 25.95,33.06 U$1.IN5
  Bottom 0.305: 5.MP 15.49,15.98 17.42,17.91 17.42,21.66 15.97,23.11 v15.49,23.11
IN6  (via drill 0.35)
  Top 0.305: 13.93,25.53 R18.2 v15.49,25.65 16.76,25.65 25.3,34.19 U$1.IN6
  Bottom 0.305: 6.MP 19.3,22.95 16.6,25.65 v15.49,25.65
IN7  (via drill 0.35)
  Top 0.305: 24.65,35.32 U$1.IN7 17.36,28.19 v15.49,28.19 R19.2
  Bottom 0.305: 7.MP 23.11,21.68 16.6,28.19 v15.49,28.19
INTB
  Top 0.305: U$1.INTB 25.95,40.22 25.65,39.93 22.77,39.93 R20.2 22.06,38.7 21.84,38.48 LSP25.MP
N$1
  Top 0.305: D1.A 44.73,30.47 44.73,24.61 42.66,22.53 R2.1
N$2
  Top 0.559: R1.1 59.71,29.94 D2.A
N$4
  Top 0.559: D4.A 44.73,42.15 R11.1
SCL
  Top 0.305: IC1.4 33.13,61.12 34.03,62.02 36.27,62.02 37.07,61.22 R10.1 38.51,58.64 38.51,56.59 D3.1 27.9,45.98 U$1.SCL
SDA  (via drill 0.35)
  Top 0.305: IC1.2 34.61,60.12 R9.1 34.75,60.08 v35.8,61.13 | v38.22,61 39.61,59.61 39.61,54.68 34.46,49.53 D5.1 33.66,48.89 28.55,43.79 U$1.SDA
  Bottom 0.305: v35.8,61.13 38.09,61.13 v38.22,61
VREF
  Top 0.305: U$1.VREF 29.2,41.9 31.15,43.85 | 31.15,43.85 C8.1 | 31.15,43.85 C9.1

### Text on the board
tPlace: EDGE | RJ45 / Open Ag / Standard | GND | 24V | GND | 24V | ADC A1 Adress | ADC A0 Adress | Barrel Jack Connector w/24V Conditioning + Fuse + LED | 24V | A1 | A0 | Address | L | L | 1Dh | L | M | 1Eh | 5-to-3V3@400mA Lin Reg | L | H | 1Fh | M | L | 2Dh | M | M | 2Eh | 3.3V | M | H | 2Fh | GND | H | L | 35h | H | M | 36h | GND | H | H | 37h | GND | GND | 5V | 3.3V | GND | 5V | Analog In | Ground | +3V3 | +5V
bPlace: INT